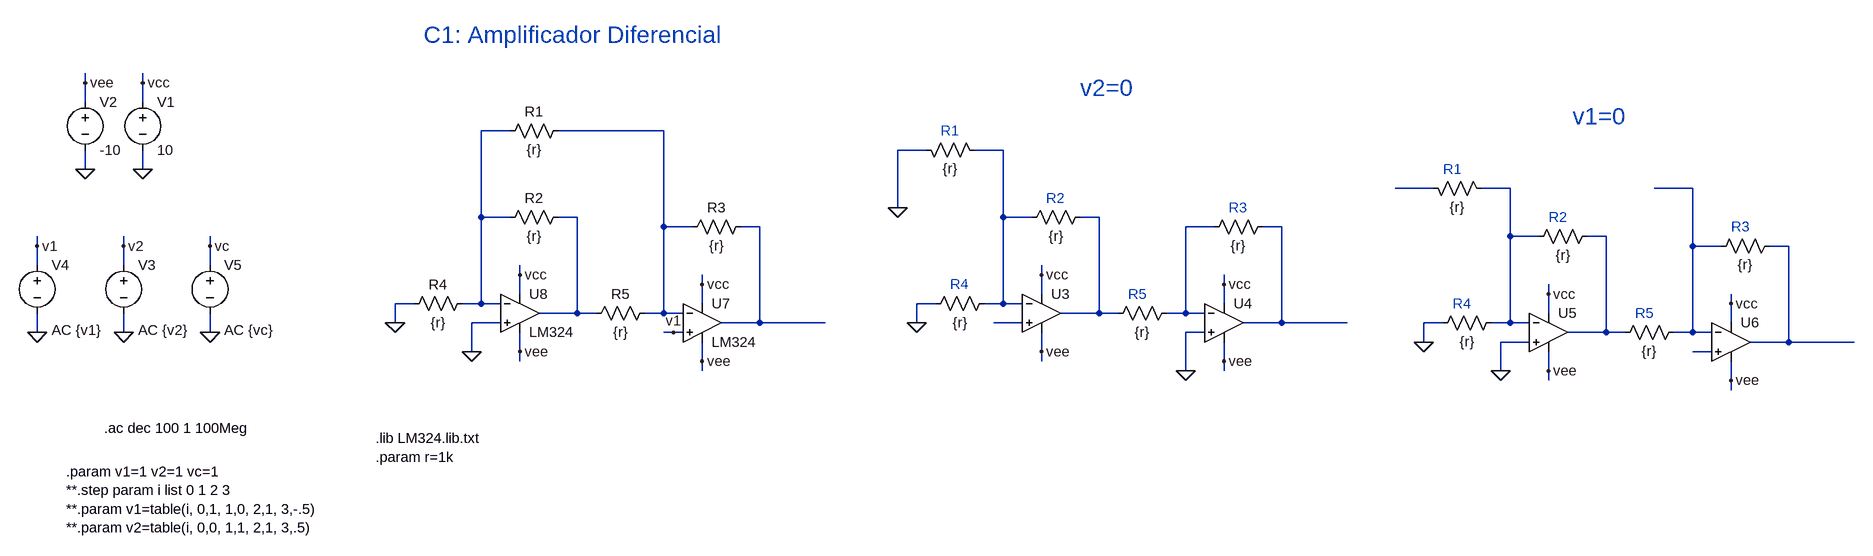
[diagram p0: schematic c1AmpDif.asc]
c1AmpDif.asc, the LTspice schematic file:
Version 4
SHEET 1 3064 680
WIRE -576 -224 -576 -240
WIRE -480 -224 -480 -240
WIRE -576 -192 -576 -224
WIRE -480 -192 -480 -224
WIRE 144 -144 96 -144
WIRE 400 -144 224 -144
WIRE 976 -112 928 -112
WIRE 1104 -112 1056 -112
WIRE -576 -80 -576 -112
WIRE -480 -80 -480 -112
WIRE 1856 -48 1792 -48
WIRE 1984 -48 1936 -48
WIRE 2288 -48 2224 -48
WIRE 928 -16 928 -112
WIRE 96 0 96 -144
WIRE 144 0 96 0
WIRE 256 0 224 0
WIRE 1104 0 1104 -112
WIRE 1152 0 1104 0
WIRE 1264 0 1232 0
WIRE 400 16 400 -144
WIRE 448 16 400 16
WIRE 560 16 528 16
WIRE 1456 16 1408 16
WIRE 1568 16 1536 16
WIRE 1984 32 1984 -48
WIRE 2032 32 1984 32
WIRE 2144 32 2112 32
WIRE -656 48 -656 32
WIRE -512 48 -512 32
WIRE -368 48 -368 32
WIRE 2288 48 2288 -48
WIRE 2336 48 2288 48
WIRE 2448 48 2416 48
WIRE -656 80 -656 48
WIRE -512 80 -512 48
WIRE -368 80 -368 48
WIRE 160 96 160 80
WIRE 1168 96 1168 80
WIRE 464 112 464 96
WIRE 1472 112 1472 96
WIRE 160 128 160 96
WIRE 1168 128 1168 96
WIRE 2048 128 2048 112
WIRE -16 144 -48 144
WIRE 96 144 96 0
WIRE 96 144 64 144
WIRE 128 144 96 144
WIRE 464 144 464 112
WIRE 992 144 960 144
WIRE 1104 144 1104 0
WIRE 1104 144 1072 144
WIRE 1136 144 1104 144
WIRE 1472 144 1472 112
WIRE 2352 144 2352 128
WIRE 256 160 256 0
WIRE 256 160 192 160
WIRE 288 160 256 160
WIRE 400 160 400 16
WIRE 400 160 368 160
WIRE 432 160 400 160
WIRE 1264 160 1264 0
WIRE 1264 160 1200 160
WIRE 1296 160 1264 160
WIRE 1408 160 1408 16
WIRE 1408 160 1376 160
WIRE 1440 160 1408 160
WIRE 2048 160 2048 128
WIRE -48 176 -48 144
WIRE 128 176 80 176
WIRE 560 176 560 16
WIRE 560 176 496 176
WIRE 704 176 560 176
WIRE 960 176 960 144
WIRE 1136 176 1088 176
WIRE 1568 176 1568 16
WIRE 1568 176 1504 176
WIRE 1712 176 1568 176
WIRE 1872 176 1840 176
WIRE 1984 176 1984 32
WIRE 1984 176 1952 176
WIRE 2016 176 1984 176
WIRE 2352 176 2352 144
WIRE -656 192 -656 160
WIRE -512 192 -512 160
WIRE -368 192 -368 160
WIRE 416 192 400 192
WIRE 432 192 416 192
WIRE 1440 192 1408 192
WIRE 2144 192 2144 32
WIRE 2144 192 2080 192
WIRE 2176 192 2144 192
WIRE 2288 192 2288 48
WIRE 2288 192 2256 192
WIRE 2320 192 2288 192
WIRE 1840 208 1840 176
WIRE 2016 208 1968 208
WIRE 2448 208 2448 48
WIRE 2448 208 2384 208
WIRE 2592 208 2448 208
WIRE 80 224 80 176
WIRE 160 224 160 192
WIRE 1168 224 1168 192
WIRE 2320 224 2288 224
WIRE 160 240 160 224
WIRE 464 240 464 208
WIRE 1168 240 1168 224
WIRE 1472 240 1472 208
WIRE 464 256 464 240
WIRE 1408 256 1408 192
WIRE 1472 256 1472 240
WIRE 1968 256 1968 208
WIRE 2048 256 2048 224
WIRE 2048 272 2048 256
WIRE 2352 272 2352 240
WIRE 2352 288 2352 272
FLAG -480 -80 0
FLAG -480 -224 vcc
FLAG -576 -80 0
FLAG -576 -224 vee
FLAG 160 224 vee
FLAG 160 96 vcc
FLAG -512 192 0
FLAG -512 48 v2
FLAG -48 176 0
FLAG 464 240 vee
FLAG 464 112 vcc
FLAG -656 192 0
FLAG -656 48 v1
FLAG 1168 224 vee
FLAG 1168 96 vcc
FLAG 960 176 0
FLAG 1472 240 vee
FLAG 1472 112 vcc
FLAG 1408 256 0
FLAG 928 -16 0
FLAG 2048 256 vee
FLAG 2048 128 vcc
FLAG 1840 208 0
FLAG 2352 272 vee
FLAG 2352 144 vcc
FLAG 1968 256 0
FLAG -368 192 0
FLAG -368 48 vc
FLAG 416 192 v1
FLAG 80 224 0
SYMBOL voltage -480 -208 R0
WINDOW 123 0 0 Left 0
WINDOW 39 0 0 Left 0
SYMATTR InstName V1
SYMATTR Value 10
SYMBOL voltage -576 -208 R0
WINDOW 123 0 0 Left 0
WINDOW 39 0 0 Left 0
SYMATTR InstName V2
SYMATTR Value -10
SYMBOL voltage -512 64 R0
WINDOW 123 24 124 Left 2
WINDOW 39 0 0 Left 0
SYMATTR Value2 AC {v2}
SYMATTR InstName V3
SYMATTR Value ""
SYMBOL res 240 -160 R90
WINDOW 0 0 56 VBottom 2
WINDOW 3 32 56 VTop 2
SYMATTR InstName R1
SYMATTR Value {r}
SYMBOL voltage -656 64 R0
WINDOW 123 24 124 Left 2
WINDOW 39 0 0 Left 0
SYMATTR Value2 AC {v1}
SYMATTR InstName V4
SYMATTR Value ""
SYMBOL res 240 -16 R90
WINDOW 0 0 56 VBottom 2
WINDOW 3 32 56 VTop 2
SYMATTR InstName R2
SYMATTR Value {r}
SYMBOL res 544 0 R90
WINDOW 0 0 56 VBottom 2
WINDOW 3 32 56 VTop 2
SYMATTR InstName R3
SYMATTR Value {r}
SYMBOL res 80 128 R90
WINDOW 0 0 56 VBottom 2
WINDOW 3 32 56 VTop 2
SYMATTR InstName R4
SYMATTR Value {r}
SYMBOL res 384 144 R90
WINDOW 0 0 56 VBottom 2
WINDOW 3 32 56 VTop 2
SYMATTR InstName R5
SYMATTR Value {r}
SYMBOL OpAmps\\UniversalOpamp2 1168 160 R0
SYMATTR InstName U3
SYMBOL OpAmps\\UniversalOpamp2 1472 176 R0
SYMATTR InstName U4
SYMBOL res 960 -128 M90
WINDOW 0 0 56 Invisible 2
WINDOW 3 32 56 VTop 2
SYMATTR InstName R6
SYMATTR Value {r}
SYMBOL res 1248 -16 R90
WINDOW 0 0 56 Invisible 2
WINDOW 3 32 56 VTop 2
SYMATTR InstName R7
SYMATTR Value {r}
SYMBOL res 1552 0 R90
WINDOW 0 0 56 Invisible 2
WINDOW 3 32 56 VTop 2
SYMATTR InstName R8
SYMATTR Value {r}
SYMBOL res 1088 128 R90
WINDOW 0 0 56 Invisible 2
WINDOW 3 32 56 VTop 2
SYMATTR InstName R9
SYMATTR Value {r}
SYMBOL res 1392 144 R90
WINDOW 0 0 56 Invisible 2
WINDOW 3 32 56 VTop 2
SYMATTR InstName R10
SYMATTR Value {r}
SYMBOL OpAmps\\UniversalOpamp2 2048 192 R0
SYMATTR InstName U5
SYMBOL OpAmps\\UniversalOpamp2 2352 208 R0
SYMATTR InstName U6
SYMBOL res 1840 -64 M90
WINDOW 0 0 56 Invisible 2
WINDOW 3 32 56 VTop 2
SYMATTR InstName R11
SYMATTR Value {r}
SYMBOL res 2128 16 R90
WINDOW 0 0 56 Invisible 2
WINDOW 3 32 56 VTop 2
SYMATTR InstName R12
SYMATTR Value {r}
SYMBOL res 2432 32 R90
WINDOW 0 0 56 Invisible 2
WINDOW 3 32 56 VTop 2
SYMATTR InstName R13
SYMATTR Value {r}
SYMBOL res 1968 160 R90
WINDOW 0 0 56 Invisible 2
WINDOW 3 32 56 VTop 2
SYMATTR InstName R14
SYMATTR Value {r}
SYMBOL res 2272 176 R90
WINDOW 0 0 56 Invisible 2
WINDOW 3 32 56 VTop 2
SYMATTR InstName R15
SYMATTR Value {r}
SYMBOL voltage -368 64 R0
WINDOW 123 24 124 Left 2
WINDOW 39 0 0 Left 0
SYMATTR Value2 AC {vc}
SYMATTR InstName V5
SYMATTR Value ""
SYMBOL OpAmps\\opamp2 160 96 R0
SYMATTR InstName U8
SYMATTR Value LM324
SYMBOL OpAmps\\opamp2 464 112 R0
SYMATTR InstName U7
SYMATTR Value LM324
TEXT -608 424 Left 2 !.param v1=1 v2=1 vc=1\n**.step param i list 0 1 2 3\n**.param v1=table(i, 0,1, 1,0, 2,1, 3,-.5)\n**.param v2=table(i, 0,0, 1,1, 2,1, 3,.5)
TEXT -80 368 Left 2 !.lib LM324.lib.txt
TEXT 0 -304 Left 4 ;C1: Amplificador Diferencial
TEXT -80 400 Left 2 !.param r=1k
TEXT -544 352 Left 2 !.ac dec 100 1 100Meg
TEXT 1000 -144 Left 2 ;R1
TEXT 1176 -32 Left 2 ;R2
TEXT 1480 -16 Left 2 ;R3
TEXT 1016 112 Left 2 ;R4
TEXT 1312 128 Left 2 ;R5
TEXT 1232 -216 Left 4 ;v2=0
TEXT 1872 -80 Left 2 ;R1
TEXT 2048 0 Left 2 ;R2
TEXT 1888 144 Left 2 ;R4
TEXT 2192 160 Left 2 ;R5
TEXT 2352 16 Left 2 ;R3
TEXT 2088 -168 Left 4 ;v1=0

The netlist it stands for:
* c1AmpDif.asc
V1 vcc 0 10
V2 vee 0 -10
V3 v2 0 AC {v2}
R1 N002 N001 {r}
V4 v1 0 AC {v1}
R2 N007 N001 {r}
R3 N009 N002 {r}
R4 N001 0 {r}
R5 N002 N007 {r}
XU3 N014 N003 vcc vee N008 level.2 Avol=1Meg GBW=10Meg Slew=10Meg ilimit=25m rail=0 Vos=0 phimargin=45 en=0 enk=0 in=0 ink=0 Rin=500Meg  ; pins IN+ IN- V+ V- OUT
XU4 0 N010 vcc vee N011 level.2 Avol=1Meg GBW=10Meg Slew=10Meg ilimit=25m rail=0 Vos=0 phimargin=45 en=0 enk=0 in=0 ink=0 Rin=500Meg  ; pins IN+ IN- V+ V- OUT
R6 0 N003 {r}
R7 N008 N003 {r}
R8 N011 N010 {r}
R9 N003 0 {r}
R10 N010 N008 {r}
XU5 0 N005 vcc vee N012 level.2 Avol=1Meg GBW=10Meg Slew=10Meg ilimit=25m rail=0 Vos=0 phimargin=45 en=0 enk=0 in=0 ink=0 Rin=500Meg  ; pins IN+ IN- V+ V- OUT
XU6 N015 N006 vcc vee N013 level.2 Avol=1Meg GBW=10Meg Slew=10Meg ilimit=25m rail=0 Vos=0 phimargin=45 en=0 enk=0 in=0 ink=0 Rin=500Meg  ; pins IN+ IN- V+ V- OUT
R11 N004 N005 {r}
R12 N012 N005 {r}
R13 N013 N006 {r}
R14 N005 0 {r}
R15 N006 N012 {r}
V5 vc 0 AC {vc}
XU8 0 N001 vcc vee N007 LM324  ; pins In+ In- V+ V- OUT
XU7 v1 N002 vcc vee N009 LM324  ; pins In+ In- V+ V- OUT
.param v1=1 v2=1 vc=1
**.step param i list 0 1 2 3
**.param v1=table(i, 0,1, 1,0, 2,1, 3,-.5)
**.param v2=table(i, 0,0, 1,1, 2,1, 3,.5)
.lib LM324.lib.txt
* C1: Amplificador Diferencial
.param r=1k
.ac dec 100 1 100Meg
* R1
* R2
* R3
* R4
* R5
* v2=0
* R1
* R2
* R4
* R5
* R3
* v1=0
.lib UniversalOpamps2.sub
.backanno
.end